# EAGLE design adapter (EAGLE 9.6.2)
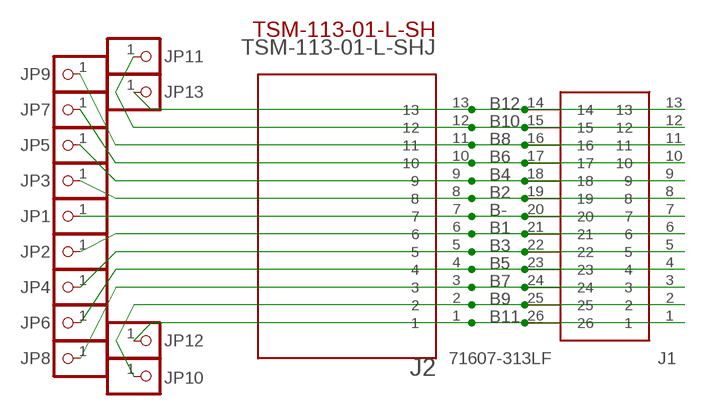
[diagram p0: schematic, sheet 1]

## Parts
J1  71607-313LF  [71607313LF]
J2  TSM-113-01-L-SHJ  [TSM-113-01-L-SH]
JP1  PINHD-1X1  [1X01BIG]
JP2  PINHD-1X1  [1X01BIG]
JP3  PINHD-1X1  [1X01BIG]
JP4  PINHD-1X1  [1X01BIG]
JP5  PINHD-1X1  [1X01BIG]
JP6  PINHD-1X1  [1X01BIG]
JP7  PINHD-1X1  [1X01BIG]
JP8  PINHD-1X1  [1X01BIG]
JP9  PINHD-1X1  [1X01BIG]
JP10  PINHD-1X1  [1X01BIG]
JP11  PINHD-1X1  [1X01BIG]
JP12  PINHD-1X1  [1X01BIG]
JP13  PINHD-1X1  [1X01BIG]

## Nets
B1 [batsense]: J1.6 J1.21 J2.6 JP2.1
B2 [batsense]: J1.8 J1.19 J2.8 JP3.1
B3 [batsense]: J1.5 J1.22 J2.5 JP4.1
B4 [batsense]: J1.9 J1.18 J2.9 JP5.1
B5 [batsense]: J1.4 J1.23 J2.4 JP6.1
B6 [batsense]: J1.10 J1.17 J2.10 JP7.1
B7 [batsense]: J1.3 J1.24 J2.3 JP8.1
B8 [batsense]: J1.11 J1.16 J2.11 JP9.1
B9 [batsense]: J1.2 J1.25 J2.2 JP10.1
B10 [batsense]: J1.12 J1.15 J2.12 JP11.1
B11 [batsense]: J1.1 J1.26 J2.1 JP12.1
B12 [batsense]: J1.13 J1.14 J2.13 JP13.1
B- [batsense]: J1.7 J1.20 J2.7 JP1.1

## Library data of the parts
J1 = ltobms:71607-313LF: DUBOX / Tube RoHS Compliant: Yes Source: Datasheet; DESCRIPTION: DUBOX / Tube RoHS Compliant: Yes; HEIGHT: 3.29mm; MANUFACTURER_NAME: Amphenol; MANUFACTURER_PART_NUMBER: 71607-313LF; MOUSER_PART_NUMBER: 649-71607-313LF; MOUSER_PRICE-STOCK: https://www.mouser.co.uk/ProductDetail/Amphenol-FCI/71607-313LF?qs=yJYkLTYh574OxHiM9YZfow%3D%3D
J2 = ltobms:TSM-113-01-L-SH
JP1-JP13 = ltobms:PINHD-1X1: PIN HEADER

## Net classes
1 batsense: width 0.305 mm

## Board
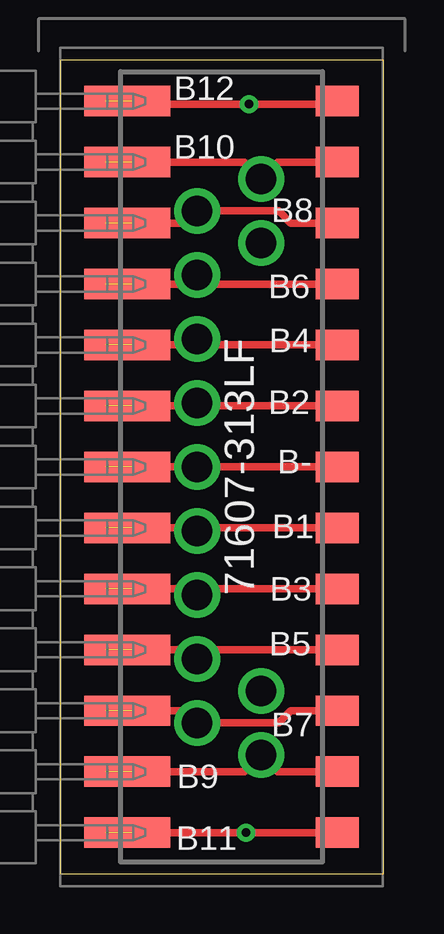
[diagram p1: board, top side]
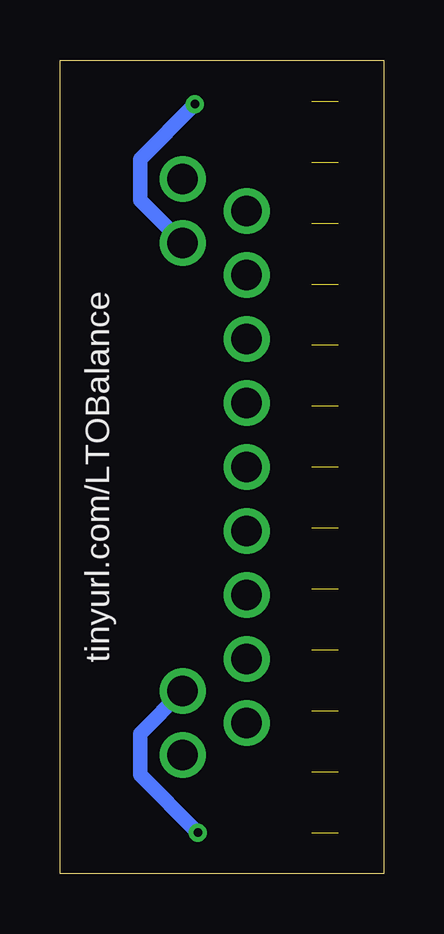
[diagram p2: board, bottom side, seen from below]

Size 13.49 x 33.91 mm. Coordinates in mm from the lower left corner, seen from the top.
Outline: 0,0 13.49,0 13.49,33.91 0,33.91 0,0
Copper layers (1*16): Top 0.035mm / dielectric 1.5mm / Bottom 0.035mm
Design rules "default": minimum track width 6mil, minimum drill 0.35mm, track to track 6mil, track to pad 6mil, pad to pad 6mil, via to via 6mil, smd to smd 6mil, copper to edge 40mil, drill to drill 6mil, minimum pad ring 10mil, minimum via ring 8mil, stop-mask expansion 4mil, vias tented up to drill 0mil, thermal gap 10mil

### Footprints (pad centres in the part's own frame; a part is rotated, then mirrored left to right if it is on the bottom)
71607313LF = smd 1.27 x 1.78: 1 -15.24,-4.825; 2 -12.7,-4.825; 3 -10.16,-4.825; 4 -7.62,-4.825; 5 -5.08,-4.825; 6 -2.54,-4.825; 7 0,-4.825; 8 2.54,-4.825; 9 5.08,-4.825; 10 7.62,-4.825; 11 10.16,-4.825; 12 12.7,-4.825; 13 15.24,-4.825; 14 15.24,4.825; 15 12.7,4.825; 16 10.16,4.825; 17 7.62,4.825; 18 5.08,4.825; 19 2.54,4.825; 20 0,4.825; 21 -2.54,4.825; 22 -5.08,4.825; 23 -7.62,4.825; 24 -10.16,4.825; 25 -12.7,4.825; 26 -15.24,4.825
TSM-113-01-L-SH = smd 1.27 x 3.18: 1 -15.24,-5.283; 2 -12.7,-5.283; 3 -10.16,-5.283; 4 -7.62,-5.283; 5 -5.08,-5.283; 6 -2.54,-5.283; 7 0,-5.283; 8 2.54,-5.283; 9 5.08,-5.283; 10 7.62,-5.283; 11 10.16,-5.283; 12 12.7,-5.283; 13 15.24,-5.283
1X01BIG = drill 1.27: 1 0,0

### Placement (x,y rotation side)
J1  6.73,16.95 90 top
J2  -2.29,16.95 90 top
JP1  5.71,16.95 0 top
JP2  5.71,14.29 0 top
JP3  5.71,19.62 0 top
JP4  5.71,11.62 0 top
JP5  5.71,22.29 0 top
JP6  5.71,8.95 0 top
JP7  5.71,24.96 0 top
JP8  5.71,6.29 0 top
JP9  5.71,27.62 0 top
JP10  8.38,4.95 0 top
JP11  8.38,28.96 0 top
JP12  8.38,7.62 0 top
JP13  8.38,26.29 0 top

### Tracks (layer width: path | path; a pad name or v marks a point on that pad's centre or on a via)
B1  (1 unrouted)
  Top 0.305: J1.21 5.59,14.41 JP2.1 5.84,14.41 J1.6
B2  (1 unrouted)
  Top 0.305: J1.19 5.59,19.49 JP3.1 5.84,19.49 J1.8
B3  (1 unrouted)
  Top 0.305: J1.22 5.46,11.87 JP4.1 5.97,11.87 J1.5
B4  (1 unrouted)
  Top 0.305: J1.18 5.46,22.04 JP5.1 5.97,22.04 J1.9
B5  (1 unrouted)
  Top 0.305: J1.23 5.33,9.33 JP6.1 6.1,9.33 J1.4
B6  (1 unrouted)
  Top 0.305: J1.17 5.33,24.57 JP7.1 6.1,24.57 J1.10
B7  (1 unrouted)
  Top 0.305: J1.3 9.62,6.79 9.11,6.29 JP8.1 5.21,6.79 J1.24
B8  (1 unrouted)
  Top 0.305: J1.16 5.21,27.11 JP9.1 9.11,27.62 9.62,27.11 J1.11
B9  (1 unrouted)
  Top 0.305: J1.25 7.68,4.25 JP10.1 9.08,4.25 J1.2
B10  (1 unrouted)
  Top 0.305: J1.15 7.68,29.65 JP11.1 9.08,29.65 J1.12
B11  (via drill 0.35)  (1 unrouted)
  Top 0.305: J1.26 v7.75,1.71 J1.1
  Bottom 0.61: JP12.1 10.16,5.84 10.16,4.13 v7.75,1.71
B12  (via drill 0.35)  (1 unrouted)
  Top 0.305: J1.14 2.03,32.07 v7.87,32.07 11.43,32.07 J1.13
  Bottom 0.61: JP13.1 10.16,28.07 10.16,29.78 v7.87,32.07
B-  (1 unrouted)
  Top 0.305: J1.20 JP1.1 J1.7

### Text on the board
tNames: B12 | B10 | B8 | B6 | B4 | B2 | B- | B1 | B3 | B5 | B7 | B9 | B11
bNames: tinyurl.com/LTOBalance